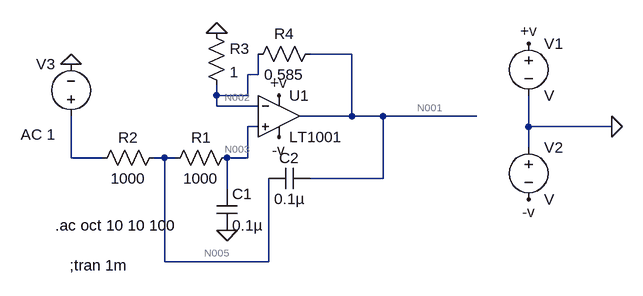
[diagram p0: schematic Draft25.asc]
Draft25.asc, the LTspice schematic file:
Version 4
SHEET 1 880 680
WIRE 288 48 224 48
WIRE 144 80 144 48
WIRE 144 80 128 80
WIRE 80 112 80 96
WIRE 128 112 128 80
WIRE 128 112 80 112
WIRE 80 128 80 112
WIRE 144 128 80 128
WIRE 288 144 288 48
WIRE 288 144 208 144
WIRE 336 144 288 144
WIRE 480 144 336 144
WIRE 144 160 128 160
WIRE 560 160 560 112
WIRE 688 160 560 160
WIRE 560 192 560 160
WIRE -144 208 -144 144
WIRE -96 208 -144 208
WIRE 0 208 -16 208
WIRE 16 208 0 208
WIRE 128 208 128 160
WIRE 128 208 96 208
WIRE 336 240 336 144
WIRE 336 240 224 240
WIRE 96 256 96 208
WIRE 0 368 0 208
WIRE 160 368 160 240
WIRE 160 368 0 368
FLAG 80 16 0
FLAG 176 112 +v
FLAG 560 32 +v
FLAG 176 176 -v
FLAG 560 272 -v
FLAG 96 320 0
FLAG 688 160 0
FLAG -144 64 0
SYMBOL Opamps\\LT1001 176 80 R0
SYMATTR InstName U1
SYMBOL res 64 0 R0
SYMATTR InstName R3
SYMATTR Value 1
SYMBOL res 240 32 R90
WINDOW 0 0 56 VBottom 2
WINDOW 3 32 56 VTop 2
SYMATTR InstName R4
SYMATTR Value 0.585
SYMBOL res 112 192 R90
WINDOW 0 0 56 VBottom 2
WINDOW 3 32 56 VTop 2
SYMATTR InstName R1
SYMATTR Value 1000
SYMBOL res 0 192 R90
WINDOW 0 0 56 VBottom 2
WINDOW 3 32 56 VTop 2
SYMATTR InstName R2
SYMATTR Value 1000
SYMBOL cap 80 256 R0
SYMATTR InstName C1
SYMATTR Value 0.1µ
SYMBOL cap 224 224 R90
WINDOW 0 0 32 VBottom 2
WINDOW 3 32 32 VTop 2
SYMATTR InstName C2
SYMATTR Value 0.1µ
SYMBOL voltage 560 16 R0
SYMATTR InstName V1
SYMBOL voltage 560 176 R0
SYMATTR InstName V2
SYMBOL voltage -144 160 R180
WINDOW 0 24 96 Left 2
WINDOW 3 24 16 Left 2
WINDOW 123 24 -12 Left 2
WINDOW 39 0 0 Left 2
SYMATTR InstName V3
SYMATTR Value ""
SYMATTR Value2 AC 1
TEXT -146 374 Left 2 !;tran 1m
TEXT -168 312 Left 2 !.ac oct 10 10 100

The netlist it stands for:
* Draft25.asc
XU1 N003 N002 +v -v N001 LT1001  ; pins In+ In- V+ V- OUT
R3 0 N002 1
R4 N001 N002 0.585
R1 N003 N005 1000
R2 N005 N004 1000
C1 N003 0 0.1µ
C2 N001 N005 0.1µ
V1 +v 0 V
V2 0 -v V
V3 N004 0 AC 1
;tran 1m
.ac oct 10 10 100
.lib LTC.lib
.backanno
.end

* Results of the author's LTspice run, read from the files saved beside the schematic
* Operating Point, zero values left out:
*   V(n002) = 136.5 nV
*   V(n003) = 3.686 pV
*   V(n001) = 216.4 nV
*   V(n005) = 1.843 pV
*   I(R4) = 136.5 nA
*   I(R3) = -136.5 nA
*   I(V2) = -83.73 pA
*   I(V1) = 13.12 nA
*   Ix(u1:3) = -13.12 nA
*   Ix(u1:4) = -83.73 pA
*   Ix(u1:5) = -136.5 nA
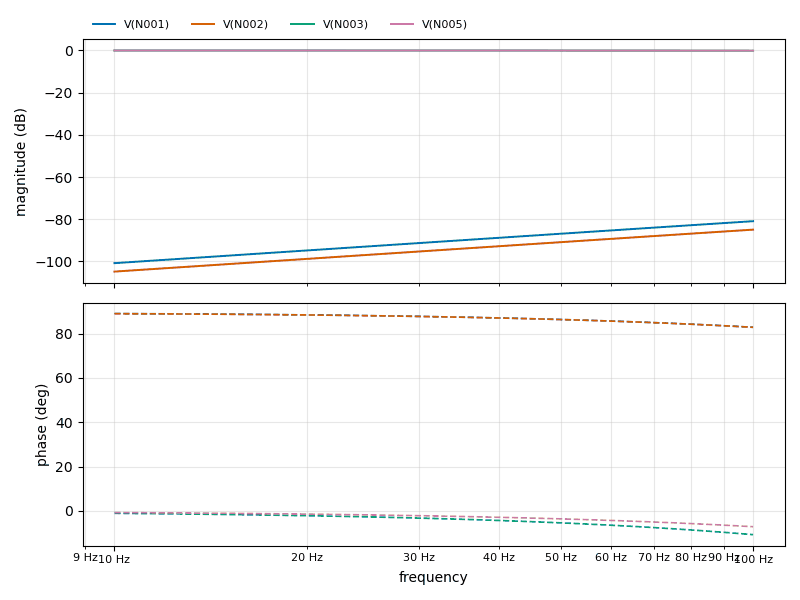
[diagram p1: AC Analysis of Draft25.asc, plotted from the saved traces]
* AC Analysis, 1 run:
*   V(N001): -100.83 dB at 10 Hz, -80.93 dB at 100 Hz, peak -80.93 dB at 100 Hz, 3 dB below the peak at 70.3 Hz
*   V(N002): -104.83 dB at 10 Hz, -84.93 dB at 100 Hz, peak -84.93 dB at 100 Hz, 3 dB below the peak at 70.3 Hz
*   V(N003): -0.00 dB at 10 Hz, -0.12 dB at 100 Hz, peak -0.00 dB at 10 Hz
*   V(N005): -0.00 dB at 10 Hz, -0.10 dB at 100 Hz, peak -0.00 dB at 10 Hz